# Altium schematic sheet NodeSensor.SchDoc
size A
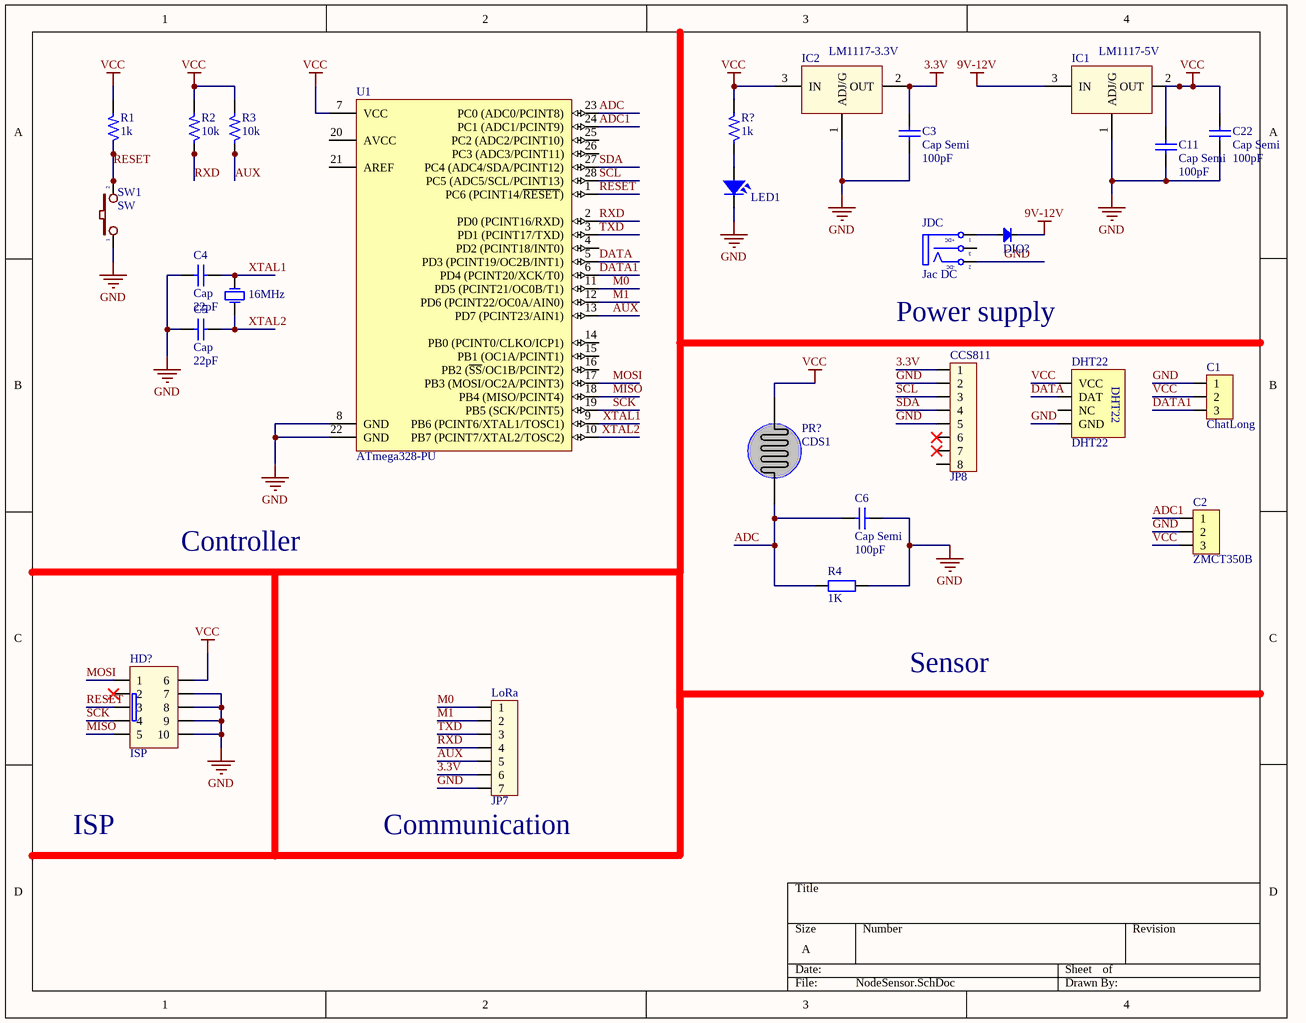
[diagram p0: NodeSensor.SchDoc]

## Parts
C1  ChatLong  [HDR3]
C2  ZMCT350B  [HDR3]
C3  Cap Semi  value 100pF  [C1210]
C4  Cap  value 22pF  [C1210]
C5  Cap  value 22pF  [C1210]
C6  Cap Semi  value 100pF  [C1210]
C11  Cap Semi  value 100pF  [C1210]
C22  Cap Semi  value 100pF  [C1210]
CCS811  JP8  [Header8]
DHT22  DHT22  [JP4-C1T]
DIO?  Diode SMD  [DIO-SMD-106]  (value not drawn)
HD?  ISP  [Hed2X5]
IC1  LM1117-5V  [SOT223-4N]
IC2  LM1117-3.3V  [SOT223-4N]
JDC  Jac DC  [DC0]
LED1  LED SMD  [SM-LED-1206-Blue]  (value not drawn)
LoRa  JP7  [Header7]
PR?  CDS1  [LED-5-WHITE]
R1  1k  [SM-RES-1206]
R2  10k  [SM-RES-1206]
R3  10k  [SM-RES-1206]
R4  1K  [RM-1206]
R?  1k  [RM-1206]
SW1  SW  [SW1-SMD]
U1  ATmega328-PU  [DIP28]
Y?  16MHz  [XTAL]

## Nets
3.3V: C3.2 CCS811.1 IC2.2(OUT) LoRa.6
9V-12V: DIO?.2(K) IC1.3(IN)
GND: C1.1 C2.2 C3.1 C4.1 C5.1 C6.2 C11.1 C22.1 CCS811.2 CCS811.5 DHT22.4(GND) HD?.7 HD?.8 HD?.9 HD?.10 IC1.1(ADJ/G) IC2.1(ADJ/G) JDC.2(TN) LED1.2 LoRa.7 R4.2 SW1.1 U1.8(GND) U1.22(GND)
VCC: C1.2 C2.3 C11.2 C22.2 DHT22.1(VCC) HD?.6 IC1.2(OUT) IC2.3(IN) PR?.2 R1.2 R2.2 R3.2 R?.2 U1.7(VCC)
ADC: C6.1 PR?.1 R4.1 U1.23(PC0_(ADC0/PCINT8))
ADC1: C2.1 U1.24(PC1_(ADC1/PCINT9))
AUX: LoRa.5 R3.1 U1.13(PD7_(PCINT23/AIN1))
DATA: DHT22.2(DAT) U1.5(PD3_(PCINT19/OC2B/INT1))
DATA1: C1.3 U1.6(PD4_(PCINT20/XCK/T0))
M0: LoRa.1 U1.11(PD5_(PCINT21/OC0B/T1))
M1: LoRa.2 U1.12(PD6_(PCINT22/OC0A/AIN0))
MISO: HD?.5 U1.18(PB4_(MISO/PCINT4))
MOSI: HD?.1 U1.17(PB3_(MOSI/OC2A/PCINT3))
RESET: HD?.3 R1.1 SW1.2 U1.1(PC6_(PCINT14/~{RESET}))
RXD: LoRa.4 R2.1 U1.2(PD0_(PCINT16/RXD))
SCK: HD?.4 U1.19(PB5_(SCK/PCINT5))
SCL: CCS811.3 U1.28(PC5_(ADC5/SCL/PCINT13))
SDA: CCS811.4 U1.27(PC4_(ADC4/SDA/PCINT12))
TXD: LoRa.3 U1.3(PD1_(PCINT17/TXD))
XTAL1: C4.2 U1.9(PB6_(PCINT6/XTAL1/TOSC1)) Y?.2(OSC2)
XTAL2: C5.2 U1.10(PB7_(PCINT7/XTAL2/TOSC2)) Y?.1(OSC1)
NetDIO?_1: DIO?.1(A) JDC.1(T)
NetLED1_1: LED1.1 R?.1

Not connected (* = marked no-connect by the designer): CCS811 6* 7* 8; DHT22 3(NC); HD? 2*; JDC 3(S); U1 4(PD2_(PCINT18/INT0)) 14(PB0_(PCINT0/CLKO/ICP1)) 15(PB1_(OC1A/PCINT1)) 16(PB2_(~{SS}/OC1B/PCINT2)) 20(AVCC) 21(AREF) 25(PC2_(ADC2/PCINT10)) 26(PC3_(ADC3/PCINT11))

## Notes on the sheet
- Power supply
- Controller
- Sensor
- ISP
- (near LoRa) Communication
- (in symbol DCIN) +DC; -DC

## Library data of the parts
C1 C2 = Header3: Header IDC, 3 x 1 Pin Vertical 2.54mm Pitch (Non-Boxed, Male); Manufacturer: W¨¹rth Elektronik eiSos GmbH; partNo: 613002143121; ComponentLink1 Description: Manufacturer; ComponentLink2 Description: Datasheet; NoPins: 02; Created Date: 29 March 2013; ComponentLink1URL: http://www.we-online.com; ComponentLink2URL: http://katalog.we-online.de/em/datasheet/6130xx143121.pdf; Created by: Karrer Zheng
C3-C6 C11 C22 = Cap Semi: Capacitor (Semiconductor SIM Model); Published: 8-Jun-2000; LatestRevisionDate: 29-May-2009; LatestRevisionNote: IPC-7351 Footprint Added.; PackageReference: C1206; Publisher: Altium Limited; PackageDescription: Chip Capacitor
CCS811 = Header8: Connector 8; Value: Connector 8
DHT22 = DHT22: Manufacturer: W¨¹rth Elektronik eiSos GmbH; partNo: 613004143121; ComponentLink1 Description: Manufacturer; ComponentLink2 Description: Datasheet; NoPins: 04; Created Date: 29 March 2013; ComponentLink1URL: http://www.we-online.com; ComponentLink2URL: http://katalog.we-online.de/em/datasheet/6130xx143121.pdf; Created by: Karrer Zheng
DIO? = Diode SMD: Default Diode; Code - JEDEC: DO-214-AB; Value: 1N5007; Published: 8-Jun-2000; Revision: July-2002: Re-released for DXP Platform.; Publisher: Altium Limited
HD? = HED5x2: Header 5x2; Value: Header 5x2
IC1 IC2 = LM1117: Available in 1.8V, 2.5V, 2.85V, 3.3V, 5V, and  Adjustable Versions; Value: LM317
JDC = DCIN: Jac DC input; Value: Jac DC
LED1 = LED-SMD-1206
LoRa = Header7: Connector 7; Value: Connector 7
PR? = CDS1: Photoresistor; Creator: Bien Nguyen
R1-R3 R? = R: Resistor 1/4W; Value: R1/4W - 1K
R4 = RM: Resistor SMD; Value: 1K
SW1 = SW2: Switch button 2 pin; Value: SW chip 2 pin
U1 = ATmega328-PU: 8-bit AVR Microcontroller, 32KB Flash, 1KB EEPROM, 2KB SRAM, 28-pin PDIP, Industrial Grade (-40°C to 85°C); Published: 1-Apr-2010; DatasheetVersion: revA, Jan-2010; PackageVersion: revB, Sep-2001; PackageReference: 28P3; Publisher: Altium Limited; PackageDescription: 28-lead (0.300"/7.62mm Wide) Plastic Dual Inline Package (PDIP); Supplier 1: Digi-Key; Supplier Part Number 1: ATMEGA328-PU-ND; Supplier 2: Mouser; Supplier Part Number 2: 556-ATMEGA328-PU; ComponentLink1Description: Manufacturer Link; ComponentLink1URL: http://www.atmel.com/products/avr/default.asp?; ComponentLink2Description: ATmega48A/48PA/88A/88PA/168A/168PA/328/328P Datasheet; ComponentLink2URL: http://www.atmel.com/dyn/resources/prod_documents/8271.pdf; ComponentLink3Description: ATmega48A/48PA/88A/88PA/168A/168PA/328/328P Summary; ComponentLink3URL: http://www.atmel.com/dyn/resources/prod_documents/8271S.pdf; ComponentLink4Description: Atmel.com Home; ComponentLink4URL: http://www.atmel.com
Y? = XTAL: Crystal Oscillator; Published: 8-Jun-2000; LatestRevisionDate: 17-Jul-2002; LatestRevisionNote: Re-released for DXP Platform.; PackageReference: R38; Publisher: Altium Limited